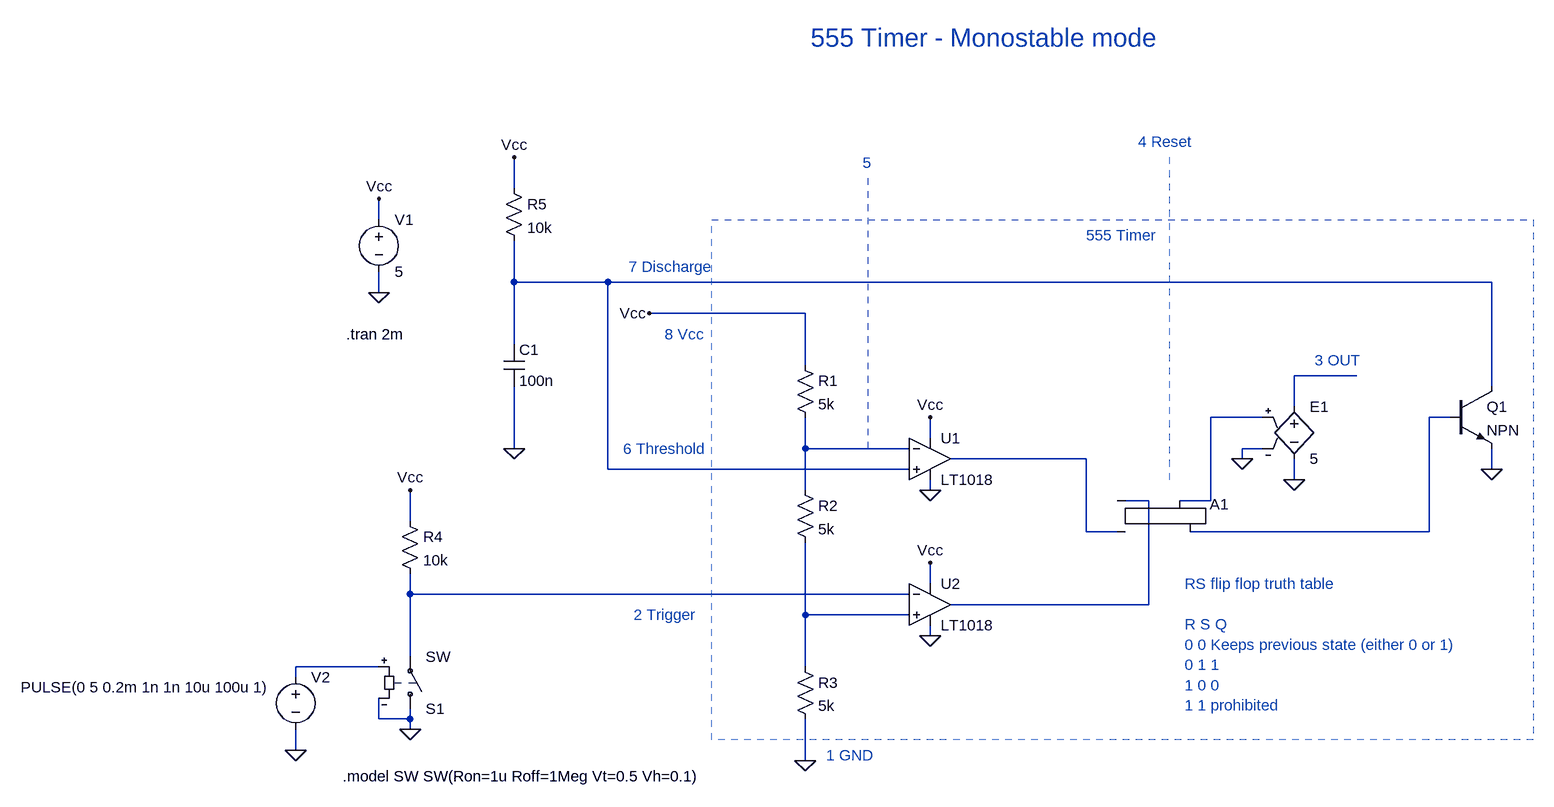
[diagram p0: schematic 555 - Monostable mode.asc]
555 - Monostable mode.asc, the LTspice schematic file:
Version 4.1
SHEET 1 1844 1080
WIRE 272 96 272 48
WIRE 64 144 64 112
WIRE 272 240 272 176
WIRE 416 240 272 240
WIRE 1776 240 416 240
WIRE 64 256 64 224
WIRE 720 288 480 288
WIRE 272 336 272 240
WIRE 720 368 720 288
WIRE 1568 384 1472 384
WIRE 1776 400 1776 240
WIRE 1472 432 1472 384
WIRE 1424 448 1344 448
WIRE 1712 448 1680 448
WIRE 912 480 912 448
WIRE 272 496 272 400
WIRE 720 496 720 448
WIRE 880 496 720 496
WIRE 1424 496 1392 496
WIRE 1152 512 944 512
WIRE 1392 512 1392 496
WIRE 416 528 416 240
WIRE 880 528 416 528
WIRE 1776 528 1776 496
WIRE 1472 544 1472 512
WIRE 720 560 720 496
WIRE 912 560 912 544
WIRE 1248 576 1200 576
WIRE 1344 576 1344 448
WIRE 1344 576 1296 576
WIRE 112 608 112 560
WIRE 1152 624 1152 512
WIRE 1200 624 1152 624
WIRE 1680 624 1680 448
WIRE 1680 624 1312 624
WIRE 912 704 912 672
WIRE 112 720 112 688
WIRE 880 720 112 720
WIRE 1248 736 1248 576
WIRE 1248 736 944 736
WIRE 720 752 720 640
WIRE 880 752 720 752
WIRE 912 784 912 768
WIRE 112 816 112 720
WIRE 64 832 -64 832
WIRE 720 832 720 752
WIRE -64 848 -64 832
WIRE 64 912 64 880
WIRE 112 912 112 896
WIRE 112 912 64 912
WIRE 112 928 112 912
WIRE -64 960 -64 928
WIRE 720 976 720 912
FLAG 272 496 0
FLAG 720 976 0
FLAG 64 256 0
FLAG 912 560 0
FLAG 912 784 0
FLAG 64 112 Vcc
FLAG 112 560 Vcc
FLAG 480 288 Vcc
FLAG 912 448 Vcc
FLAG 912 672 Vcc
FLAG 1776 528 0
FLAG 1392 512 0
FLAG 1472 544 0
FLAG 272 48 Vcc
FLAG 112 928 0
FLAG -64 960 0
SYMBOL Digital\\srflop 1248 528 R0
SYMATTR InstName A1
SYMBOL res 704 352 R0
SYMATTR InstName R1
SYMATTR Value 5k
SYMBOL res 704 544 R0
SYMATTR InstName R2
SYMATTR Value 5k
SYMBOL res 704 816 R0
SYMATTR InstName R3
SYMATTR Value 5k
SYMBOL res 96 592 R0
SYMATTR InstName R4
SYMATTR Value 10k
SYMBOL res 256 80 R0
SYMATTR InstName R5
SYMATTR Value 10k
SYMBOL cap 256 336 R0
SYMATTR InstName C1
SYMATTR Value 100n
SYMBOL Comparators\\LT1018 912 512 R0
SYMATTR InstName U1
SYMBOL Comparators\\LT1018 912 736 R0
SYMATTR InstName U2
SYMBOL voltage 64 128 R0
WINDOW 123 0 0 Left 0
WINDOW 39 0 0 Left 0
SYMATTR InstName V1
SYMATTR Value 5
SYMBOL npn 1712 400 R0
SYMATTR InstName Q1
SYMBOL e 1472 416 R0
SYMATTR InstName E1
SYMATTR Value 5
SYMBOL sw 112 912 M180
SYMATTR InstName S1
SYMBOL voltage -64 832 R0
WINDOW 3 -423 31 Left 2
WINDOW 123 0 0 Left 0
WINDOW 39 0 0 Left 0
SYMATTR InstName V2
SYMATTR Value PULSE(0 5 0.2m 1n 1n 10u 100u 1)
TEXT 14 320 Left 2 !.tran 2m
TEXT 752 968 Left 2 ;1 GND
TEXT 456 752 Left 2 ;2 Trigger
TEXT 440 496 Left 2 ;6 Threshold
TEXT 504 320 Left 2 ;8 Vcc
TEXT 1504 360 Left 2 ;3 OUT
TEXT 1152 168 Left 2 ;555 Timer
TEXT 448 216 Left 2 ;7 Discharge
TEXT 1232 24 Left 2 ;4 Reset
TEXT 808 56 Left 2 ;5
TEXT 728 -136 Left 4 ;555 Timer - Monostable mode
TEXT 1304 704 Left 2 ;RS flip flop truth table\n \nR S Q\n0 0 Keeps previous state (either 0 or 1)\n0 1 1\n1 0 0\n1 1 prohibited
TEXT 8 1000 Left 2 !.model SW SW(Ron=1u Roff=1Meg Vt=0.5 Vh=0.1)
LINE Normal 1280 48 1280 544 2
LINE Normal 816 80 816 496 2
RECTANGLE Normal 1840 944 576 144 2

The netlist it stands for:
* 555 - Monostable mode.asc
A1 N007 N006 0 0 0 N004 N003 0 SRFLOP
R1 Vcc N005 5k
R2 N005 N009 5k
R3 N009 0 5k
R4 Vcc N008 10k
R5 Vcc N001 10k
C1 N001 0 100n
X§U1 N001 N005 Vcc 0 N006 LT1018  ; pins In+ In- V+ V- OUT
X§U2 N009 N008 Vcc 0 N007 LT1018  ; pins In+ In- V+ V- OUT
V1 Vcc 0 5
Q1 N001 N004 0 0 NPN
E1 N002 0 N003 0 5
S1 0 N008 N010 0 SW
V2 N010 0 PULSE(0 5 0.2m 1n 1n 10u 100u 1)
.model NPN NPN
.model PNP PNP
.lib standard.bjt
.tran 2m
* 1 GND
* 2 Trigger
* 6 Threshold
* 8 Vcc
* 3 OUT
* 555 Timer
* 7 Discharge
* 4 Reset
* 5
* 555 Timer - Monostable mode
* RS flip flop truth table
* R S Q
* 0 0 Keeps previous state (either 0 or 1)
* 0 1 1
* 1 0 0
* 1 1 prohibited
.model SW SW(Ron=1u Roff=1Meg Vt=0.5 Vh=0.1)
.lib LTC1.lib
.backanno
.end